# Altium schematic sheet remoteFK01.SchDoc
size A
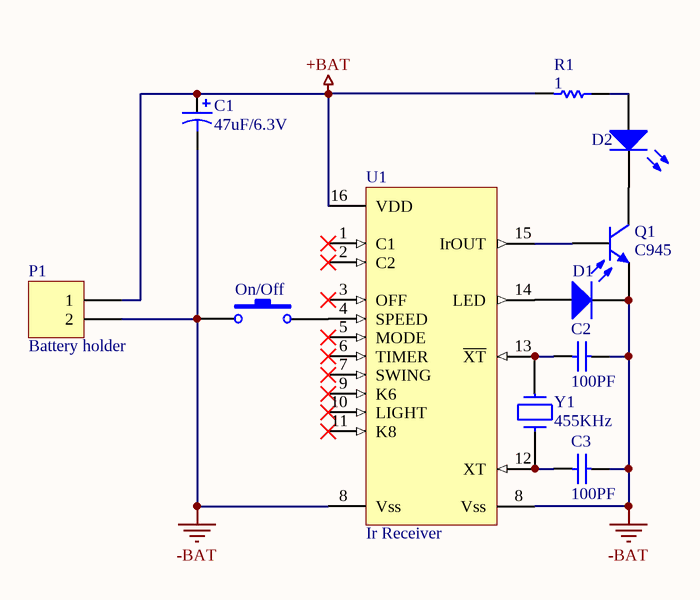
[diagram p0: remoteFK01.SchDoc]

## Parts
C1  47uF/6.3V  [RB.1/.2]
C2  100PF  [RAD0.1]
C3  100PF  [RAD0.1]
D1  Red  [LED0.3]  (value not drawn)
D2  Ir Transmitter  [LED0.5-L]  (value not drawn)
P1  Battery holder  [BatHol22]
Q1  C945  [TO92BS2]
R1  1  [RES0.35]
S1  On/Off  [PUSHBOT2]
U1  Ir Receiver  [SOIC16]
Y1  455KHz  [XTALRLOB]

## Nets
+BAT: C1.1 P1.1 R1.2 U1.16(VDD)
-BAT: C1.2 C2.1 C3.1 D1.2(K) P1.2 Q1.3(E) S1.1 U1.8(Vss)
NetC2_2: C2.2 U1.13(~{XT}) Y1.1
NetC3_2: C3.2 U1.12(XT) Y1.2
NetD1_1: D1.1(A) U1.14(LED)
NetD2_1: D2.1(A) R1.1
NetD2_2: D2.2(K) Q1.2(C)
NetQ1_1: Q1.1(B) U1.15(IrOUT)
NetS1_2: S1.2 U1.4(SPEED)

Not connected (* = marked no-connect by the designer): U1 1(C1)* 2(C2)* 3(OFF)* 5(MODE)* 6(TIMER)* 7(SWING)* 9(K6)* 10(LIGHT)* 11(K8)*

## Library data of the parts
C1 = Cap Pol1: Polarized Capacitor (SMD); Value: 47uF/10V; Published: 8-Jun-2000; LatestRevisionDate: 17-Jul-2002; LatestRevisionNote: Re-released for DXP Platform.; PackageReference: RB7.6-15; Publisher: Altium Limited
C2 C3 = Cap: Capacitor np; Value: 120pF; Published: 8-Jun-2000; LatestRevisionDate: 17-Jul-2002; LatestRevisionNote: Re-released for DXP Platform.; PackageReference: RAD-0.3; Publisher: Altium Limited
D1 = LED0.5: LED Radial 0.3; Published: 8-Jun-2000; LatestRevisionDate: 17-Dec-2003; LatestRevisionNote: PCB Footprint replaced.; DatasheetDocument: 16-Apr-2002; PackageDocument: 16-Apr-2002; PackageReference: 3.5X2.8X1.9; Publisher: Altium Limited
D2 = LED0.5: LED Radial 0.5; Published: 8-Jun-2000; LatestRevisionDate: 17-Dec-2003; LatestRevisionNote: PCB Footprint replaced.; DatasheetDocument: 16-Apr-2002; PackageDocument: 16-Apr-2002; PackageReference: 3.5X2.8X1.9; Publisher: Altium Limited
P1 = Header 2: Header, 2-Pin; LatestRevisionDate: 17-Jul-2002; LatestRevisionNote: Re-released for DXP Platform.; Publisher: Altium Limited
Q1 = BC337: NPN General Purpose Amplifier; Published: 8-Jun-2000; LatestRevisionDate: 15-Jan-2003; LatestRevisionNote: PCB Footprint 'BCY-W3/D4.7' replaced; DatasheetDocument: 1997; PackageDocument: Sep-1998; PackageReference: TO-92A; Publisher: Altium Limited; Code_JEDEC: TO-92A; ComponentLink1Description: Manufacturer Link; ComponentLink1URL: http://www.fairchildsemi.com/; ComponentLink2Description: Datasheet; ComponentLink2URL: http://www.fairchildsemi.com/ds/2N%2F2N3904.pdf
R1 = Resistor: Published: 8-Jun-2000; LatestRevisionDate: 17-Jul-2002; LatestRevisionNote: Re-released for DXP Platform.; PackageReference: AXIAL-0.5; Publisher: Altium Limited
S1 = SW-PB: 6x6x5; Published: 24-Mar-1999; LatestRevisionDate: 17-Jul-2002; LatestRevisionNote: Re-released for DXP Platform.; PackageReference: SPST-2; Publisher: Altium Limited
U1 = SC5104: Fan Ir. Receiver
Y1 = CRYSTAL